# EAGLE design Adafruit Metro ESP32-S3 Rev B (EAGLE 9.6.2)
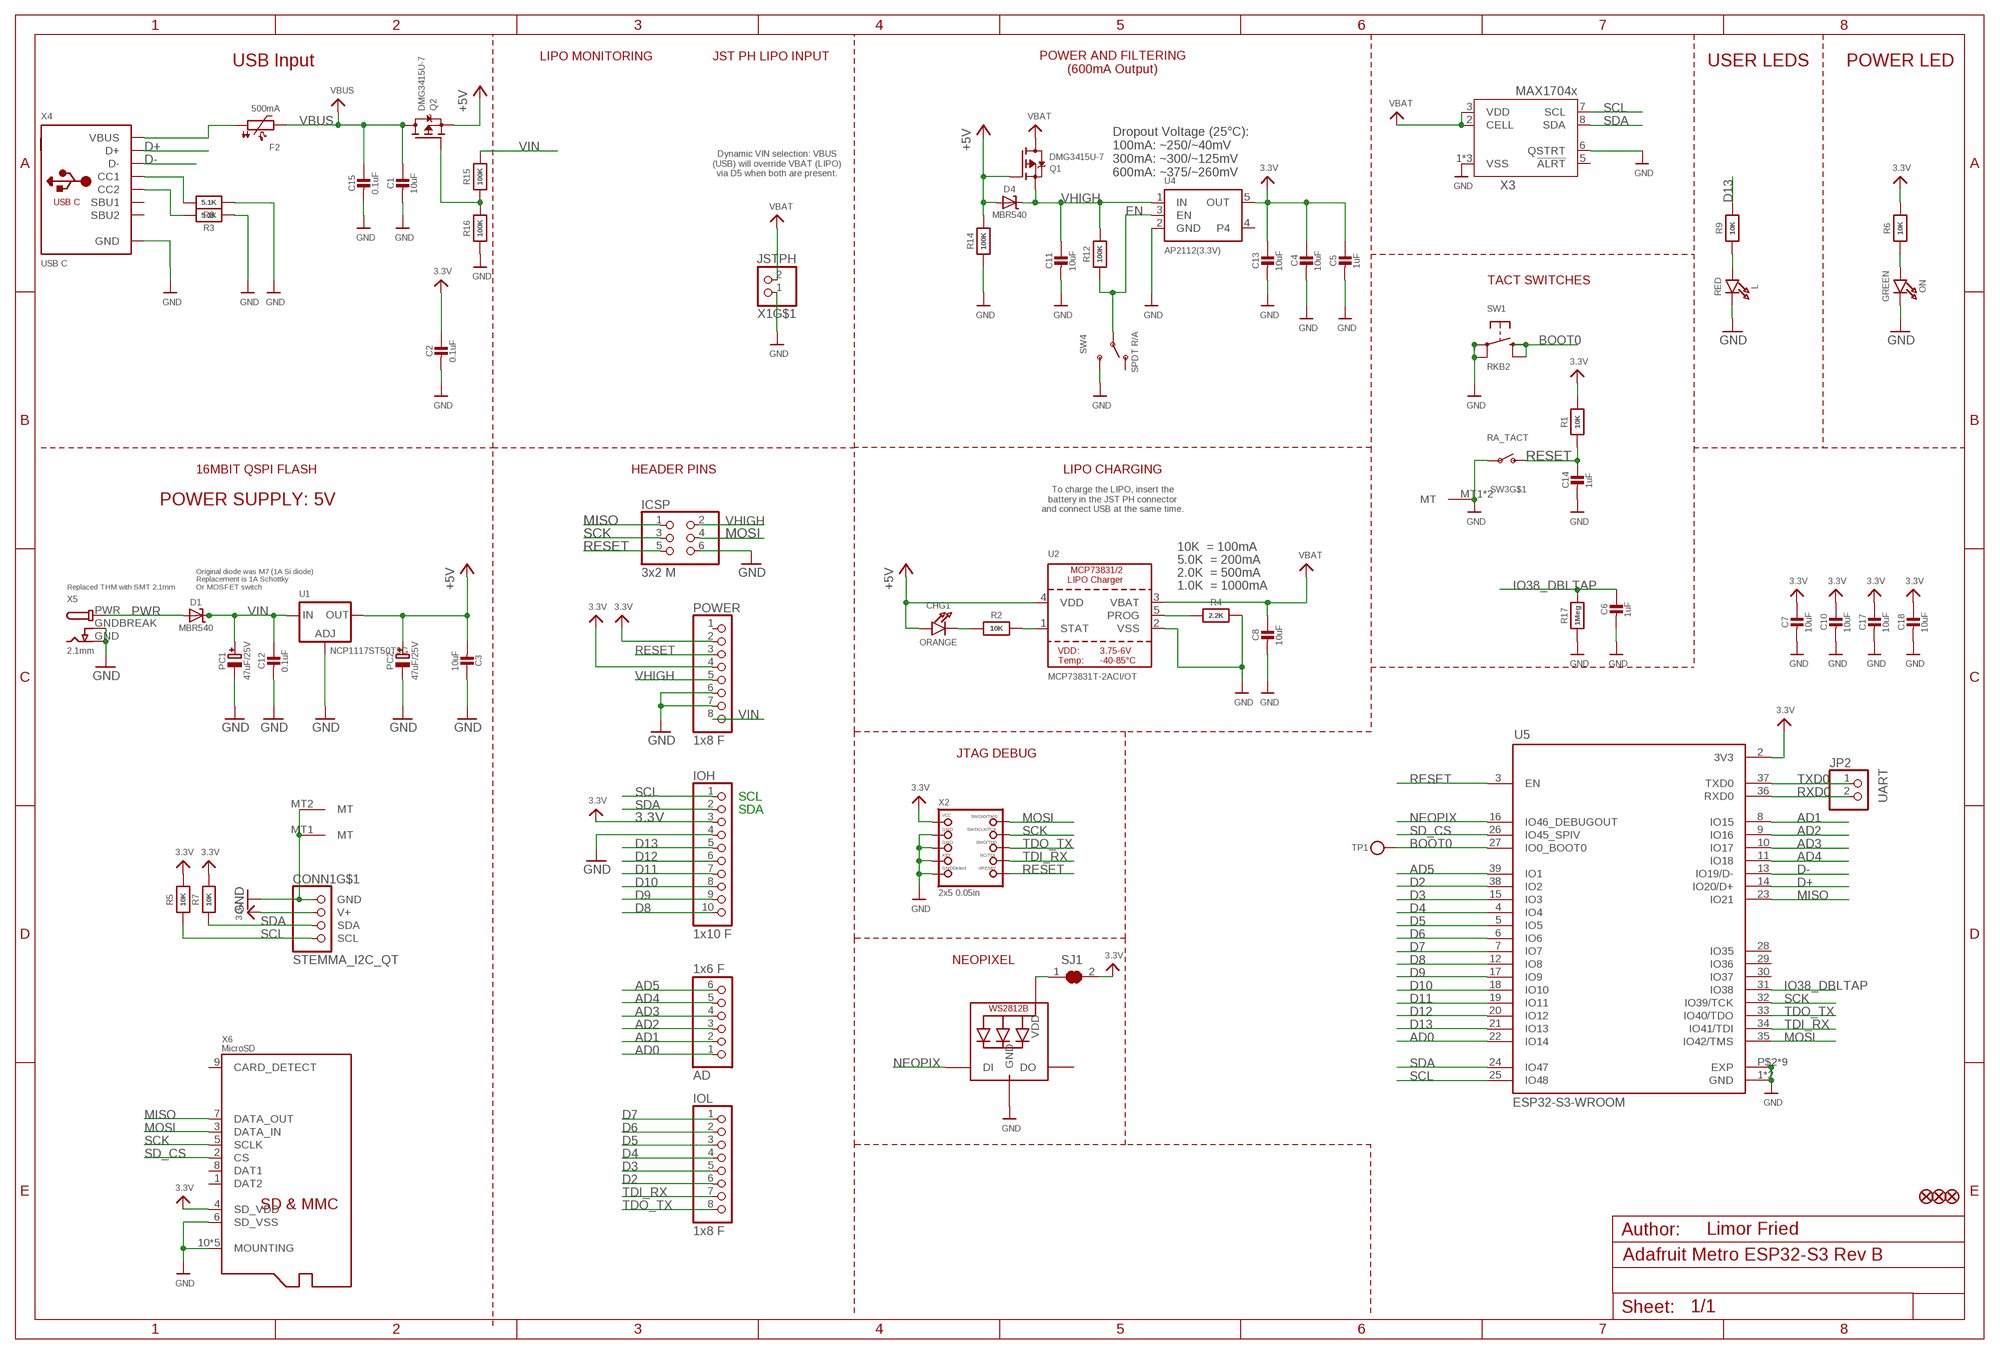
[diagram p0: schematic, sheet 1]

## Parts
AD  1x6 F  HEADER-1X6OVALWAVE  [1X06_OVALWAVE]
C1  10uF  CAP_CERAMIC0805-NOOUTLINE  [0805-NO]
C2  0.1uF  CAP_CERAMIC0603_NO  [0603-NO]
C3  10uF  CAP_CERAMIC0805-NOOUTLINE  [0805-NO]
C4  10uF  CAP_CERAMIC0805-NOOUTLINE  [0805-NO]
C5  1uF  CAP_CERAMIC0603_NO  [0603-NO]
C6  1uF  CAP_CERAMIC0603_NO  [0603-NO]
C7  10uF  CAP_CERAMIC0805-NOOUTLINE  [0805-NO]
C8  10uF  CAP_CERAMIC0805-NOOUTLINE  [0805-NO]
C10  10uF  CAP_CERAMIC0805-NOOUTLINE  [0805-NO]
C11  10uF  CAP_CERAMIC0805-NOOUTLINE  [0805-NO]
C12  0.1uF  CAP_CERAMIC0603_NO  [0603-NO]
C13  10uF  CAP_CERAMIC0805-NOOUTLINE  [0805-NO]
C14  1uF  CAP_CERAMIC0603_NO  [0603-NO]
C15  0.1uF  CAP_CERAMIC0603_NO  [0603-NO]
C17  10uF  CAP_CERAMIC0805-NOOUTLINE  [0805-NO]
C18  10uF  CAP_CERAMIC0805-NOOUTLINE  [0805-NO]
CHG1  ORANGE  LED0603_NOOUTLINE  [CHIPLED_0603_NOOUTLINE]
CONN1  STEMMA_I2C_QT  [JST_SH4]
D1  MBR540  DIODE-SCHOTTKYSOD-123  [SOD-123]
D4  MBR540  DIODE-SCHOTTKYSOD-123  [SOD-123]
F2  500mA  PTC_0805  [0805-NO]
FD1  FIDUCIAL_1MM  [FIDUCIAL_1MM]
FD2  FIDUCIAL_1MM  [FIDUCIAL_1MM]
FD3  FIDUCIAL_1MM  [FIDUCIAL_1MM]
ICSP  3x2 M  HEADER-2X3  [2X03_ROUND_70MIL]
IOH  1x10 F  HEADER-1X10OVALWAVE  [1X10_OVALWAVE]
IOL  1x8 F  HEADER-1X8OVALWAVE  [1X08_OVALWAVE]
JP2  UART  HEADER-1X2ROUND  [1X02_ROUND]
L  RED  LED0603_NOOUTLINE  [CHIPLED_0603_NOOUTLINE]
LED1  WS2812B_3535FULL  [LED3535_FULLPADS]
ON  GREEN  LED0603_NOOUTLINE  [CHIPLED_0603_NOOUTLINE]
PC1  47uF/25V  CAP_ELECTROLYTICPANASONIC_D  [PANASONIC_D]
PC2  47uF/25V  CAP_ELECTROLYTICPANASONIC_D  [PANASONIC_D]
POWER  1x8 F  HEADER-1X8OVALWAVE  [1X08_OVALWAVE]
Q1  DMG3415U-7  MOSFET-P  [SOT23-R]
Q2  DMG3415U-7  MOSFET-P  [SOT23-R]
R1  10K  RESISTOR_0603_NOOUT  [0603-NO]
R2  10K  RESISTOR_0603_NOOUT  [0603-NO]
R3  5.1K  RESISTOR_0603_NOOUT  [0603-NO]
R4  2.2K  RESISTOR_0603_NOOUT  [0603-NO]
R5  10K  RESISTOR_0603_NOOUT  [0603-NO]
R6  10K  RESISTOR_0603_NOOUT  [0603-NO]
R7  10K  RESISTOR_0603_NOOUT  [0603-NO]
R8  5.1K  RESISTOR_0603_NOOUT  [0603-NO]
R9  10K  RESISTOR_0603_NOOUT  [0603-NO]
R12  100K  RESISTOR_0603_NOOUT  [0603-NO]
R14  100K  RESISTOR_0603_NOOUT  [0603-NO]
R15  100K  RESISTOR_0603_NOOUT  [0603-NO]
R16  100K  RESISTOR_0603_NOOUT  [0603-NO]
R17  1Meg  RESISTOR_0603_NOOUT  [0603-NO]
SJ1  SOLDERJUMPER_CLOSED  [SOLDERJUMPER_CLOSEDWIRE]
SW1  RKB2  SWITCH_TACT_SMT_RKB2  [BTN_RKB2_4.6X2.8]
SW3  RA_TACT  SWITCH_SPST_MNT_TACT_RA  [SPST_TACTILE_RA]
SW4  SPDT R/A  SWITCH_SPDT  [SPDT_SMT_SSSS811101]
TP1  TESTPOINTROUND1.5MMNO  [TESTPOINT_ROUND_1.5MM_NO]
U1  NCP1117ST50T3G  LM1117SOT223-REFLOW  [SOT223-R]
U2  MCP73831T-2ACI/OT  MCP73831/2  [SOT23-5]
U4  AP2112(3.3V)  VREG_SOT23-5  [SOT23-5]
U5  ESP32-S3-WROOM  [S3-WROOM32]
X1  JSTPH  CON_JST_PH_2PIN_MT_BATT  [JSTPH2_BATT]
X2  2x5 0.05in  JTAG-CORTEXBOXPOSTS  [2X05_1.27MM_BOX_POSTS]
X3  MAX17048/T  [TDFN8_2X2MM]
X4  USB C  USB_C  [USB_C_CUSB31-CFM2AX-01-X]
X5  2.1mm  DCBARRELPTH  [DCJACK_2MM_PTH]
X6  MicroSD  MICROSD104031-0811  [MOLEX_104031-0811]

## Nets
3.3V [Power]: C2.1 C4.1 C5.1 C7.1 C10.1 C13.1 C17.1 C18.1 CONN1.2(V+) IOH.3 POWER.2 POWER.4 R1.2 R5.2 R6.2 R7.2 SJ1.2 U4.5(OUT) U5.2(3V3) X2.1(VCC) X6.4(SD_VDD)
+5V [Power]: C3.2 CHG1.A D4.A PC2.+ Q1.1(G) Q2.2(S) R14.2 U1.2(OUT) U1.4(OUT) U2.4(VDD)
AD0: AD.1 U5.22(IO14)
AD1: AD.2 U5.8(IO15)
AD2: AD.3 U5.9(IO16)
AD3: AD.4 U5.10(IO17)
AD4: AD.5 U5.11(IO18)
AD5: AD.6 U5.39(IO1)
BOOT0: SW1.B'(S1) SW1.B(S) TP1.P$1 U5.27(IO0_BOOT0)
D2: IOL.6 U5.38(IO2)
D3: IOL.5 U5.15(IO3)
D4: IOL.4 U5.4(IO4)
D5: IOL.3 U5.5(IO5)
D6: IOL.2 U5.6(IO6)
D7: IOL.1 U5.7(IO7)
D8: IOH.10 U5.12(IO8)
D9: IOH.9 U5.17(IO9)
D10: IOH.8 U5.18(IO10)
D11: IOH.7 U5.19(IO11)
D12: IOH.6 U5.20(IO12)
D13: IOH.5 R9.2 U5.21(IO13)
D+: U5.14(IO20/D+) X4.A6(D+) X4.B6(D+)
D-: U5.13(IO19/D-) X4.A7(D-) X4.B7(D-)
EN: R12.1 SW4.B(P) U4.3(EN)
GND [lowpower]: C1.2 C2.2 C3.1 C4.2 C5.2 C6.2 C7.2 C8.2 C10.2 C11.2 C12.2 C13.2 C14.2 C15.2 C17.2 C18.2 CONN1.1(GND) CONN1.MT1(MT) CONN1.MT2(MT) ICSP.6 IOH.4 L.C LED1.4(GND) ON.C PC1.- PC2.- POWER.6 POWER.7 R3.1 R4.2 R8.1 R14.1 R16.1 R17.1 SW1.A'(P1) SW1.A(P) SW3.1(P) SW3.MT1(MT) SW3.MT2(MT) SW4.C(S) U1.1(ADJ) U2.2(VSS) U4.2(GND) U5.1(GND) U5.40(GND) U5.P$2(EXP) U5.P$3(EXP) U5.P$4(EXP) U5.P$5(EXP) U5.P$6(EXP) U5.P$7(EXP) U5.P$8(EXP) U5.P$9(EXP) U5.P$10(EXP) X1.1 X2.3(GND) X2.5(GND) X2.7(KEY) X2.9(GNDDETECT) X3.1(VSS) X3.4(VSS) X3.6(QSTRT) X3.THERMAL(VSS) X4.A1B12(GND) X4.B1A12(GND) X5.GND X5.GNDBREAK X6.6(SD_VSS) X6.10(MOUNTING) X6.G1(MOUNTING) X6.G2(MOUNTING) X6.G3(MOUNTING) X6.G4(MOUNTING)
IO38_DBLTAP: C6.1 R17.2 U5.31(IO38)
MISO: ICSP.1 U5.23(IO21) X6.7(DATA_OUT)
MOSI: ICSP.4 U5.35(IO42/TMS) X2.2(SWDIO) X6.3(DATA_IN)
N$1: L.A R9.1
N$2: Q2.1(G) R15.1 R16.2
N$3: ON.A R6.1
N$4: CHG1.C R2.1
N$5 [Power]: LED1.2(VDD) SJ1.1
N$6: R2.2 U2.1(STAT)
N$7: R8.2 X4.A5(CC1)
N$8: R3.2 X4.B5(CC2)
N$9: R4.1 U2.5(PROG)
N$13: F2.1 X4.A4B9(VBUS) X4.B4A9(VBUS)
NEOPIX: LED1.1(DI) U5.16(IO46_DEBUGOUT)
PWR: D1.A X5.PWR
RESET: C14.1 ICSP.5 POWER.3 R1.1 SW3.2(S) U5.3(EN) X2.10(NRESET)
RXD0: JP2.2 U5.36(RXD0)
SCK: ICSP.3 U5.32(IO39/TCK) X2.4(SWDCLK) X6.5(SCLK)
SCL: CONN1.4(SCL) IOH.1 R5.1 U5.25(IO48) X3.7(SCL)
SD_CS: U5.26(IO45_SPIV) X6.2(CS)
SDA: CONN1.3(SDA) IOH.2 R7.1 U5.24(IO47) X3.8(SDA)
TDI_RX: IOL.7 U5.34(IO41/TDI) X2.8(TDI)
TDO_TX: IOL.8 U5.33(IO40/TDO) X2.6(SWO)
TXD0: JP2.1 U5.37(TXD0)
VBAT [Power]: C8.1 Q1.3(D) U2.3(VBAT) X1.2 X3.2(CELL) X3.3(VDD)
VBUS: C1.1 C15.1 F2.2 Q2.3(D)
VHIGH [Power]: C11.1 D4.C ICSP.2 POWER.5 Q1.2(S) R12.2 U4.1(IN)
VIN [USB]: C12.1 D1.C PC1.+ POWER.8 R15.2 U1.3(IN)
Unconnected: LED1.3(DO) POWER.1 SW4.A(O) U4.4 U5.28(IO35) U5.29(IO36) U5.30(IO37) X1.NC1 X1.NC2 X3.5(!ALRT) X4.A8(SBU1) X4.B8(SBU2) X6.1(DAT2) X6.8(DAT1) X6.9(CARD_DETECT)

## Notes on the sheet
- USB Input | LIPO MONITORING | JST PH LIPO INPUT | USER LEDS | POWER LED
- POWER AND FILTERING
  (600mA Output)
- Dynamic VIN selection: VBUS
  (USB) will override VBAT (LIPO)
  via D5 when both are present.
- Dropout Voltage (25°C):
  100mA: ~250/~40mV
  300mA: ~300/~125mV
  600mA: ~375/~260mV
- TACT SWITCHES
- 16MBIT QSPI FLASH | HEADER PINS | LIPO CHARGING
- POWER SUPPLY: 5V
- To charge the LIPO, insert the
  battery in the JST PH connector
  and connect USB at the same time.
- 10K  = 100mA
- 5.0K  = 200mA
- 2.0K  = 500mA
- Replaced THM with SMT 2.1mm
- Original diode was M7 (1A Si diode)
  Replacement is 1A Schottky
  Or MOSFET switch
- 1.0K  = 1000mA
- JTAG DEBUG
- SCL
- SDA
- NEOPIXEL
- Limor Fried

## Library data of the parts
AD = microbuilder:HEADER-1X6: PIN HEADER
C1-C8 C10-C15 C17 C18 = microbuilder:CAP_CERAMIC: Ceramic Capacitors For new designs, use the packages preceded by an '_' character since they are more reliable: The following footprints should be used on most boards: _0402 - Standard footprint for regular board layouts _0603 - Standard footprint for regular board layouts _0805 - Standard footprint for regular board layouts _1206 - Standard footprint for regular board layouts For extremely tight-pitch boards where space is at a premium, the following 'micro-pitch' footprints can be used (smaller pads, no silkscreen outline, etc.): _0402MP - Micro-pitch footprint for very dense/compact boards _0603MP - Micro-pitch footprint for very dense/compact boards _0805MP - Micro-pitch footprint for very dense/compact boards _1206MP - Micro-pitch footprint for very dense/compact boards
CHG1 L ON = microbuilder:LED: LED 0603 - 0603 Surface Mount Package 2mA: Green LED - Low Power (3.9mcd, 2ma, 1.7Vf) - Digikey: 475-2709-2-ND Orange LED - Low Power (9.8mcd, 2ma, 1.8Vf) - Digikey: 475-1194-2-ND Red LED - Low Power (5mcd, 2ma, 1.8Vf) - Digikey: 475-1195-2-ND Yellow LED - Low Power (7mcd, 2ma, 1.8Vf) - Digikey: 475-1196-2-ND 5mA: Blue LED - Low Power (17mcd, 5ma, 2.9Vf) - Digikey: LNJ937W8CRACT-ND 0805 - 0805 Surface Mount Package 2mA: Red LED (8.8mcd, 2mA, 1.8Vf, Clear) - Low Power [Digikey: 475-2510-1-ND] Green LED (5mcd, 2mA, 1.8Vf, Clear) - Low Power [Digikey: 475-2730-1-ND] Yellow LED (11.3mcd, 2mA, 1.8Vf, Clear) - Low Power [Digikey: 475-2555-1-ND] 20mA: Red LED (104mcd, 20mA, Diffused) - LS R976 [Digikey: 475-1278-6-ND] Red LED (12mcd, 20mA, 2.0Vf, Clear) - APT2012EC [Digikey: 754-1128-1-ND] Green LED (15mcd, 20mA, 2.2Vf, Clear) - APT2012GC [Digikey: 754-1131-1-ND] Orange LED (160mcd, 20mA, 2.1Vf, Clear) - APT2012SECK [Digikey: 754-1130-1-ND] 1206 - 1206 Surface Mount Package Green LED (26mcd, 20mA, Diffused) - LG N971 [Digikey: 475-1407-6-ND] Red LED (15mcd, 20mA, Diffused) - LH N974 [Digikey: 475-1416-6-ND] Cree - Cree High-Power Surface Mount LEDs XPEBWT-L1-0000-00D50 - White 111lm 350mA 2.9Vf 6200K 110° XTEAWT-00-0000-00000LEE3 - White 114lm 350mA 2.85Vf 5000K 115° Everlight - Everlight 45-21 Series Surface Mount LEDs 45-21/QK2C-B2832AC2CB2/2T - Warm White 2000mcd 20mA 3.25Vf 3050K 120° 45-21/LK2C-B38452C4CB2/2T - Nuetral White 2000mcd 20mA 3.25Vf 4150K 120° 45-21/LK2C-B50634C6CB2/2T - Cold White 2200mcd 20mA 3.25Vf 5650K 120° PLCC2 Reverse Mount LS T77K-J1L2-1-0-2-R18-Z - Red 11.25mcd 2mA 1.8Vf 630nm 120° LO T77K-L1M2-24-Z - Orange 19.6mcd 2mA 1.8Vf 606nm 120° LY T77K-K2M1-26-Z - Yellow 15.7mcd 2mA 1.8Vf 587nm 120°; ROT: 270
CONN1 = adafruit_electromech:STEMMA_I2C; LCSC: C2845363
D1 D4 = microbuilder:DIODE-SCHOTTKY
F2 = microbuilder:PTC: PTC (Resettable Fuse) 1206 Package 250mA PTC (16V Max, Time-to-Trip: 0.08s) - Digikey: F2110CT-ND 1210 Package 100mA PTC (30V Max, Time-to-Trip: 0.6s) - Digikey: MF-USMF010-2CT-ND 1812 Package 750mA PTC (24V Max, Time-to-Trip: 0.2s) - Digikey: MF-MSMF075/24-2CT-ND
FD1-FD3 = microbuilder:FIDUCIAL: Fiducial Alignment Points Various fiducial points for machine vision alignment.; BOM: EXCLUDE
ICSP = microbuilder:HEADER-2X3: PIN HEADER
IOH = microbuilder:HEADER-1X10: PIN HEADER
IOL POWER = microbuilder:HEADER-1X8: PIN HEADER
JP2 = microbuilder:HEADER-1X2: PIN HEADER
LED1 = microbuilder:WS2812B
PC1 PC2 = microbuilder:CAP_ELECTROLYTIC: Electrolytic Capacitors SMT PANASONIC_C - Size C Panasonic Electrolytic Aluminum Capacitor 47µF 16V 20% Electrolytic Capacitor [Digikey: PCE3890TR-ND] PANASONIC_D - Size D Panasonic Electrolytic Aluminum Capacitor 100µF 25V 20% Electrolytic Capacitor [Digikey: PCE3898TR-ND] PTH 3.5 mm grid, 8 mm diameter ... 3.5 mm grid, 10 mm diameter ...
Q1 Q2 = microbuilder:MOSFET-P: P-Channel Mosfet LEGEND VDS: Voltage Drain-Source ID: Drain Current RDS(ON): Drain-Source On-State Resistance VGS(TH): Gate-Source Threshold Voltage CISS: Drain-Source Input Capacitance SOT-23 Name VDS ID RDS(ON) VGS(TH) CISS Order Number IRLML5103 30V 760mA 600 mOhm -- 75pF @ 25V Digikey: IRLML5103PBFCT-ND IRLML6401 12V 4.3A 50 mOhm 950mV @ 250µA 830pF @ 10V Digikey: IRLML6401PBFTR-ND NTR0202PL 20V 400mA 800 mOhm 2.3V @ 250uA 70pF @ 5V Digikey: NTR0202PLT1GOSTR-ND NTR4101PT1G 20V 1.8A 85 mOhm 1.2V @ 250uA 675pF @ 10V Digikey: NTR4101PT1GOSCT-ND DMP2004K 20V 600mA 900 mOhm 1V @ 250uA 175pF @ 16V Digikey: DMP2004KDICT-ND PMV65XP 20V 3.9A 76 mOhm 950mV @ 1mA 725pF @ 20V Digikey: 568-2358-2-ND TO-252 Name VDS ID RDS(ON) VGS(TH) CISS Order Number AOD417 30V 25A 34 mOhm 3V @ 250µA 920pF @ 15V Digikey: 785-1106-2-ND PowerPak Name VDS ID RDS(ON) VGS(TH) CISS Order Number AON7401 30V 12A 14 mOhm 3V @ 250µA 2600pF @ 15V Digikey: 785-1302-1-ND
R1-R9 R12 R14-R17 = microbuilder:RESISTOR: Resistors For new designs, use the packages preceded by an '_' character since they are more reliable: The following footprints should be used on most boards: _0402 - Standard footprint for regular board layouts _0603 - Standard footprint for regular board layouts _0805 - Standard footprint for regular board layouts _1206 - Standard footprint for regular board layouts For extremely tight-pitch boards where space is at a premium, the following 'micro-pitch' footprints can be used (smaller pads, no silkscreen outline, etc.): _0402MP - Micro-pitch footprint for very dense/compact boards _0603MP - Micro-pitch footprint for very dense/compact boards _0805MP - Micro-pitch footprint for very dense/compact boards _1206MP - Micro-pitch footprint for very dense/compact boards
SJ1 = microbuilder:SOLDERJUMPER_CLOSED: Solder Jumper - Closed These solder jumpers are closed by default CLOSEDWIRE - 10 mil trace between pads that can be cut and resoldered later CLOSEDPERM - 63 mil trace between pads for a permanent connection (used to 'bridge' two signals, a shameless hack for Eagle). Can double as a test point as well (no cream layer)
SW1 = adafruit_electromech:SWITCH_TACT_SMT: SMT Tact Switches RKB2 https://www.digikey.com/short/m027prz5
SW3 = adafruit_electromech:SWITCH_SPST_MNT: Switch - SPST 4UCon 19192 (6.7x2.6mm SMT); LCSC: C778159
SW4 = adafruit_electromech:SWITCH_SPDT: Switch - SPDT SSSS811101 - Horizontal Two Position SMT, 0.3A 4V [Mouser: 688-SSSS811101]
TP1 = microbuilder:TESTPOINT: Test Point Various test points for characterisation and PCB testing TESTPOINT_SMT - Compact Surface Mount Test Point [Digikey: 5016KTR-ND]
U1 = microbuilder:LM1117: LM1117 Voltage Regulator LM1117 Adjustable Voltage regulator [Digikey: LM1117IMP-ADJDKR-ND] LM1117 3.3V Voltage regulator [AP1117E33GDIDKR-ND] LM1117 5.0V Voltage regulator [AP1117E50GDIDKR-ND] SOT223-REFLOW - SOT223 package for solder paste/reflow ovens SOT223-WAVE - SOT223 package for hand-soldering (larger pads) Note: For the fixed-voltage regulators, simply set the ADJ pin to GND.
U2 = microbuilder:MCP73831/2: MCP73831/2 LIPO Charger VDD: 3.75 - 6V Temp -40 - 85°C Programmable Charge Rate: 15-500mA NOTE: STAT is a tri-state logic output on the MCP73831 and an open-drain output on the MCP73832. SOT23-5 with 4.2V output and tri-state logic on STAT = MCP73831T-2ACI/OT; JLC_ROTATION: 0; LCSC: C424093
U4 = adafruit_power:VREG_SOT23-5: SOT23-5 Fixed Voltage Regulators Part Current Out V Out V In V Dropout θJA (°C/W) TJ (°C) Digikey Part No. ADP121 150mA 3.3V 3.4-5.5V 0.09V @ 150mA -- -- ADP121-AUJZ33R7CT-ND ADP121 150mA 3.0V 3.1-5.5V 0.09V @ 150mA -- -- ADP121-AUJZ30R7CT-ND ADP122 300mA 3.3V 3.4-5.5V 0.085V @ 300mA -- -- ADP122AUJZ-3.3-R7CT-ND ADP1712 300mA 3.3V 3.5-5.5V 0.17V @ 300mA -- -- ADP1712AUJZ-3.3-R7TR-ND AP7311 (Low Cost) 150mA 3.3V 3.5-6V 0.15V @ 150mA -- -- AP7311-33WG-7DICT-ND LD39015M18R 150mA 1.8V 1.9V-5.5V 0.08V @ 100mA -- -- 497-6977-1-ND LP2985A-33DBVR 150mA 3.3V 3.3-16V 0.28V @ 150mA 206 150 296-18479-1-ND MCP1824T-3302E/OT 300mA 3.3V 3.5V-6V 0.2V @ 300mA -- -- MCP1824T-3302E/OTCT-ND MIC5205-2.5YM5 TR 150mA 2.5V 2.7-16V 0.165V @ 150mA -- -- 576-1257-2-ND MIC5205-3.0YM5 TR 150mA 3.0V 3.2V-16V 0.165V @ 150mA -- -- 576-1258-2-ND MIC5205-3.3YM5 TR 150mA 3.3V 3.5V-16V 0.165V @ 150mA -- -- 576-1259-2-ND TPS780330220 150mA 3.3V+2.2V 3.6-5.5V 250mV Max -- -- 296-23332-1-ND TDA3663/N1,135 100mA 3.3V 3.5-45V 0.18V @ 50mA -- -- 568-5343-1-ND Max operating temp can be calculated using θJA, TJ (max junction temperature), and power in watts. Set the "Maximum Ambient Temperature" until it reaches TJ ("Max Junction Temperature"), which is the absolute limit for safe use of the regulator: Heat Sink Temperature Calculator <http://www.daycounter.com/Calculators/Heat-Sink-Temperature-Calculator.phtml> For example, With 12V source into a 3.3V LP2985 and a 30mA load, we are dissipating (12V-3.3V) * 0.03A = 0.261W. With a θJA of 206 °C/W, a TJ of 150°C, and 261mW we can safely use the chip without a heat sink up to 75°C (=147.1°C Junction Temperature).; JLC_ROTATION: 0
U5 = adafruit_wireless:ESP32-S3-WROOM: WiFi 802.11b/g/n Transceiver Module 2.4GHz Antenna Not Included Surface Mount Check prices <https://snapeda.com/parts/ESP32-S2-WROVER/Espressif%20Systems/view-part/?ref=eda>
X1 = adafruit_electromech:CON_JST_PH_2PIN_MT; LCSC: C47647
X2 = adafruit_electromech:JTAG-CORTEX: Serial Wire (SW-DP) Connector Standard 0.05" 10-pin connector is for use with the Cortex M and Cortex A SWD (serial wire debugger) interface (SW-DP) Connectors 2x05_1.27MM_SMT - Inexpensive surface-mount header with bare pins, compatible with standard 10-pin SWD cables (4UCON: 16846) 2x05_1.27MM_BOX_NOPOSTS - Polarised surface-mount box (4UCON with caps: 19735, without caps: 15117 2x05_1.27MM_BOX_POSTS - Polarised surface-mount box with mounting holes (4UCON: 20317) Pinout: http://infocenter.arm.com/help/topic/com.arm.doc.faqs/attached/13634/cortex_debug_connectors.pdf http://www.keil.com/peripherals/coresight/connectors.asp
X3 = adafruit_sensor:MAX17048; ROT: 270
X4 = adafruit_electromech:USB_C: USB Type-C USB 2.0 Connector; LCSC: C165948
X5 = adafruit_electromech:DCBARREL: DC Barrel Jack DCJACK_1.3MM_PTH - Through Hole 1.3mm Jack (4UConnector: 05536) DCJACK_2MM_PTH - Through Hole 2.0/2.1 Jack (4UConnector: 05537) DCJACK_2MM_SMT - SMT 2.0/2.1mm Jack(4UConnector: 03267)
X6 = adafruit_electromech:MICROSD: MicroSD/Transflash Card Holder with SPI pinout 3M: 2908-05WB-MG 4UConnector: 19656 Footprint courtesy: Adafruit Industries

## Net classes
2 lowpower: width 0.305 mm, drill 0.483 mm
3 Power: width 0.305 mm, drill 0.483 mm

## Board
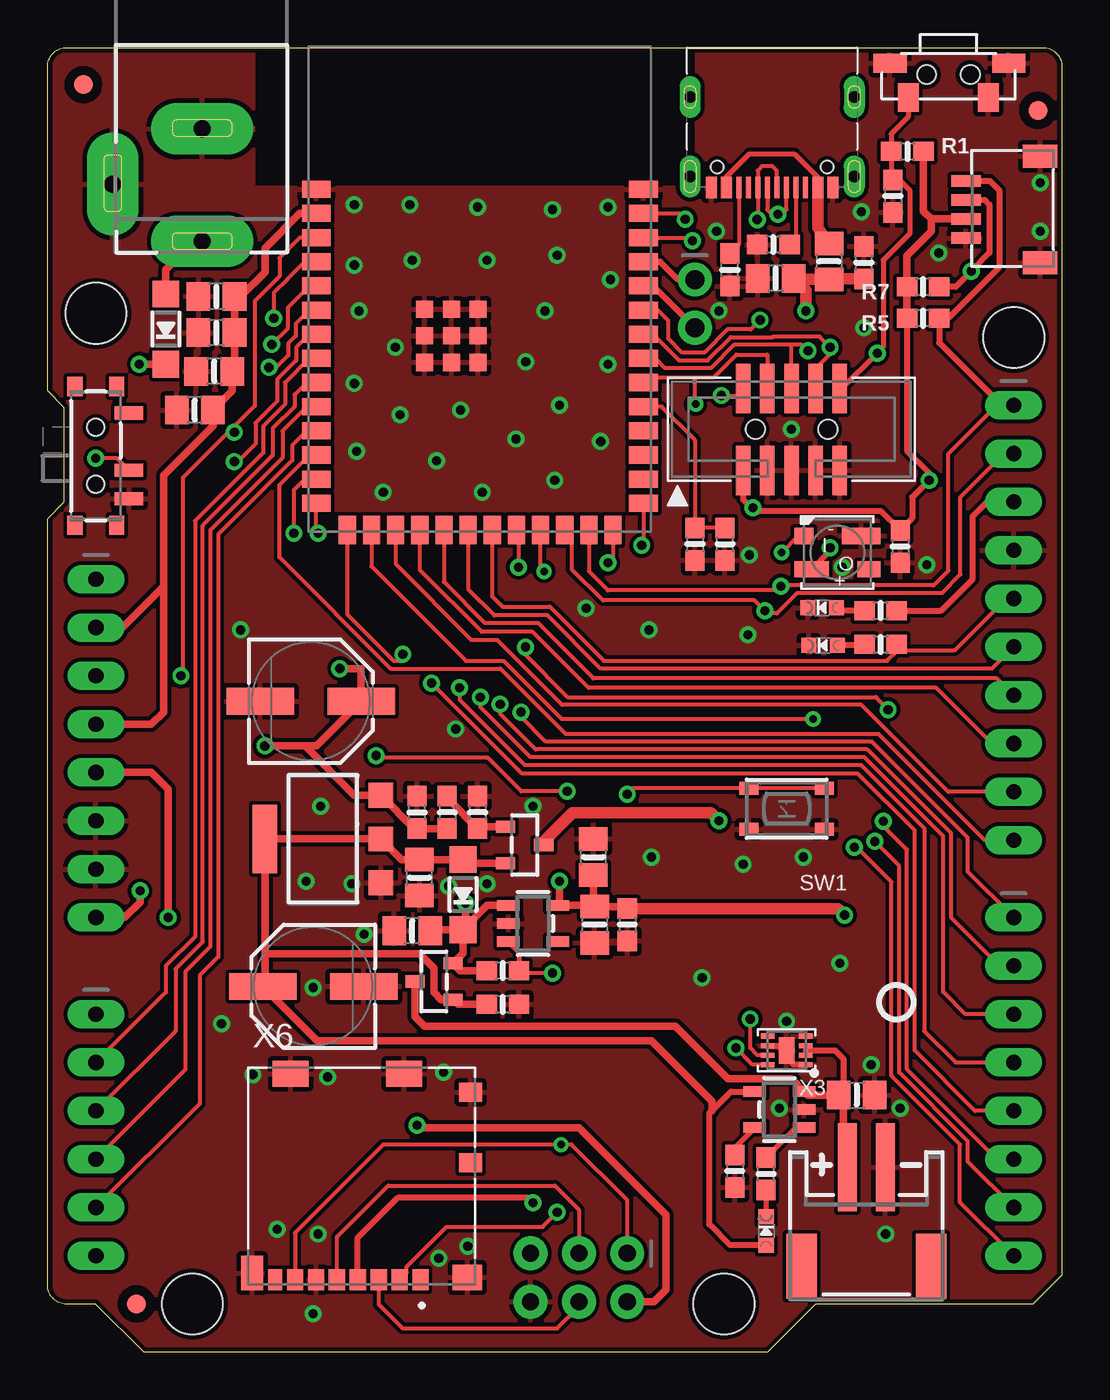
[diagram p1: board, top side]
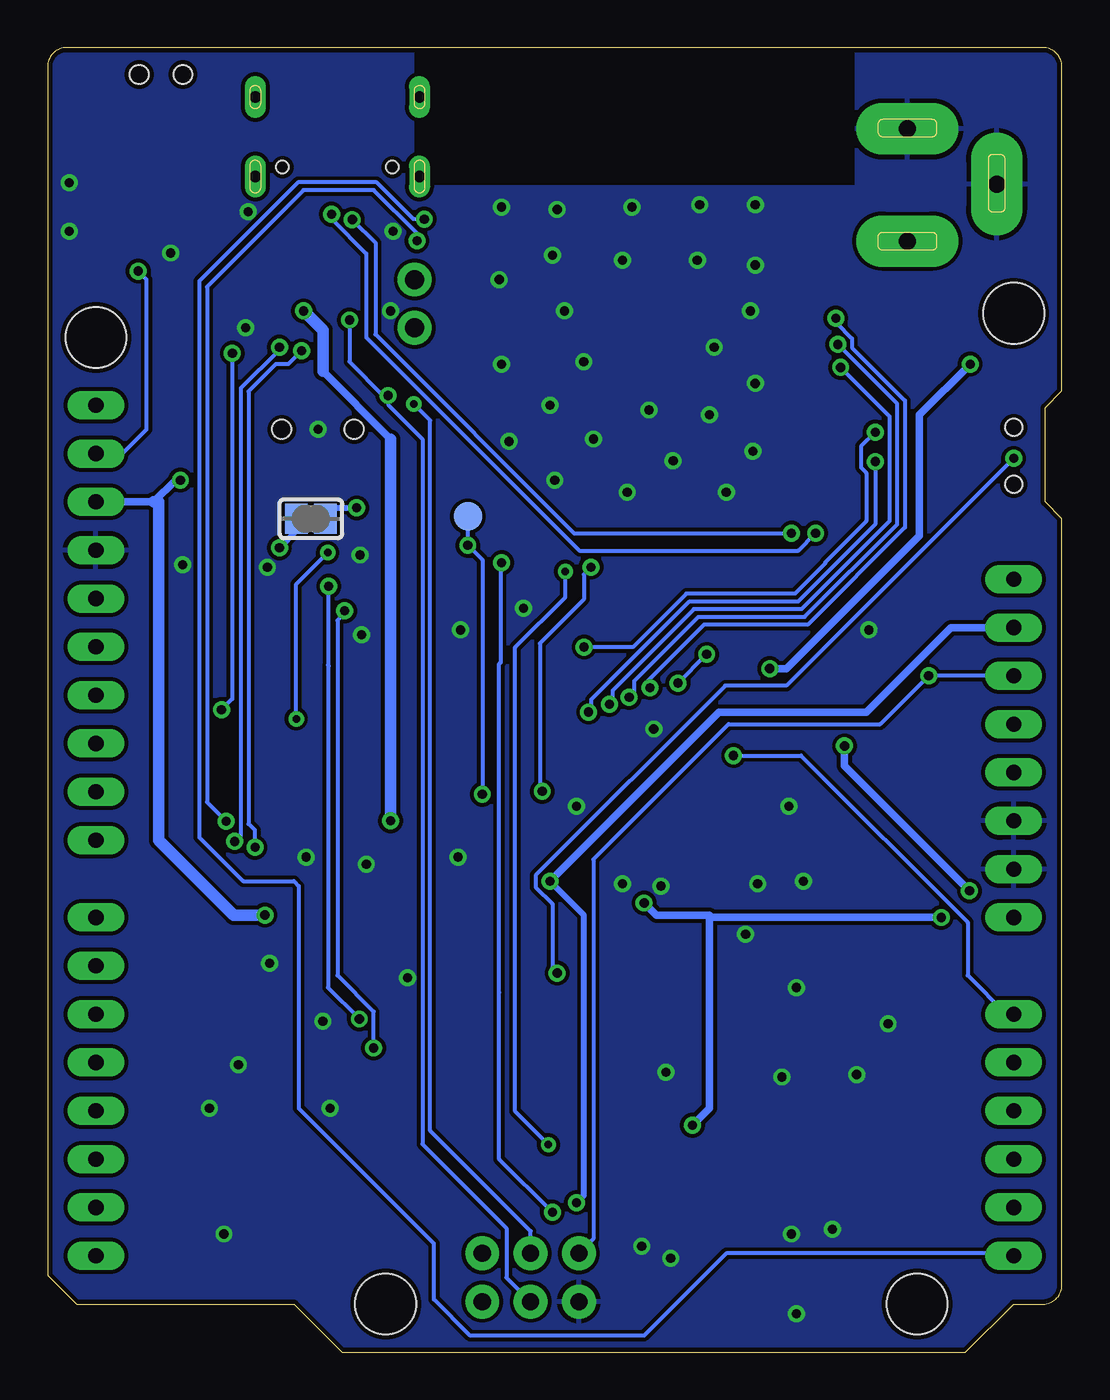
[diagram p2: board, bottom side, seen from below]

Size 53.34 x 68.58 mm. Coordinates in mm from the lower left corner, seen from the top.
Outline: 53.34,4.06 51.82,2.54 40.39,2.54 37.85,0 5.08,0 2.54,2.54 1,2.54 arc-90 0,3.54 0,43.81 0.89,44.7 0.89,49.66 0,50.55 0,67.58 arc-90 1,68.58 52.34,68.58 arc-90 53.34,67.58 53.34,4.06
Copper layers (1*16): Top 0.035mm / dielectric 1.5mm / Bottom 0.035mm
Design rules "adafruit *": minimum track width 8mil, minimum drill 15.5mil, track to track 8mil, track to pad 8mil, pad to pad 8mil, via to via 8mil, smd to smd 8mil, copper to edge 10mil, drill to drill 8mil, minimum pad ring 10mil, minimum via ring 8mil, stop-mask expansion 2mil, vias tented up to drill 20mil, thermal gap 10mil
Holes 3.2 mm at 35.56,2.54 7.62,2.54 50.8,53.34 2.54,54.61

### Footprints (pad centres in the part's own frame; a part is rotated, then mirrored left to right if it is on the bottom)
1X06_OVALWAVE = drill 0.8 pad 1.5 long: 1 -6.35,0; 2 -3.81,0; 3 -1.27,0; 4 1.27,0; 5 3.81,0; 6 6.35,0
0805-NO = smd 1.24 x 1.5: 1 -0.95,0; 2 0.95,0
0603-NO = smd 1.075 x 1: 1 -0.85,0; 2 0.85,0
CHIPLED_0603_NOOUTLINE = smd 0.8 x 0.8: A 0,-0.75; C 0,0.75
JST_SH4 = smd 0.6 x 1.55: 1 -1.5,2.006; 2 -0.5,2.006; 3 0.5,2.006; 4 1.5,2.006 | smd 1.2 x 1.8: MT1 -2.8,-1.894; MT2 2.8,-1.894
SOD-123 = smd 1.4 x 1.4: A 1.85,0; C -1.85,0
FIDUCIAL_1MM = smd 1 x 1: 1 0,0
2X03_ROUND_70MIL = drill 0.9 pad 1.778: 1 -2.54,-1.27; 2 -2.54,1.27; 3 0,-1.27; 4 0,1.27; 5 2.54,-1.27; 6 2.54,1.27
1X10_OVALWAVE = drill 0.8 pad 1.5 long: 1 -11.43,0; 2 -8.89,0; 3 -6.35,0; 4 -3.81,0; 5 -1.27,0; 6 1.27,0; 7 3.81,0; 8 6.35,0; 9 8.89,0; 10 11.43,0
1X08_OVALWAVE = drill 0.8 pad 1.5 long: 1 -8.89,0; 2 -6.35,0; 3 -3.81,0; 4 -1.27,0; 5 1.27,0; 6 3.81,0; 7 6.35,0; 8 8.89,0
1X02_ROUND = drill 1 pad 1.778: 1 -1.27,0; 2 1.27,0
LED3535_FULLPADS = smd 1 x 0.85: 1 -1.75,0.875 | smd 1.8 x 0.85: 2 -1.35,-0.875 | smd 1.2 x 0.85: 3 1.65,-0.875 | smd 2 x 0.85: 4 1.25,0.875
PANASONIC_D = smd 3.556 x 1.4: + 2.654,0; - -2.654,0
SOT23-R = smd 0.635 x 1.016: 1 -0.95,-1; 2 0.95,-1; 3 0,1
SOLDERJUMPER_CLOSEDWIRE = smd 1.168 x 1.6: 1 -0.762,0; 2 0.762,0 | smd 0.635 x 0.203: WIRE 0,0
BTN_RKB2_4.6X2.8 = smd 1 x 0.7: A 1.973,1.075; A' -1.973,1.075; B 1.973,-1.075; B' -1.973,-1.075
SPST_TACTILE_RA = smd 1.1 x 1.5: 1 2.1,-0.9; 2 -2.1,-0.9 | smd 1.75 x 1: MT1 3.175,0.9; MT2 -3.075,0.9 | hole 1: 1.15,0.3; -1.15,0.3
SPDT_SMT_SSSS811101 = smd 0.7 x 1.5: A -2.25,1.242; B 0.75,1.242; C 2.25,1.242 | smd 1 x 0.8: SUP1 -3.65,0.592; SUP2 -3.65,-1.608; SUP3 3.65,0.592; SUP4 3.65,-1.608 | hole 0.9: -1.5,-0.508; 1.5,-0.508
TESTPOINT_ROUND_1.5MM_NO = smd 1.5 x 1.5: P$1 0,0
SOT223-R = smd 1.3 x 1.3: 1 -2.3,-3.05; 2 0,-3.05; 3 2.3,-3.05 | smd 3.6 x 1.3: 4 0,3.05
SOT23-5 = smd 0.55 x 1.2: 1 -0.95,-1.3; 2 0,-1.3; 3 0.95,-1.3; 4 0.95,1.3; 5 -0.95,1.3
S3-WROOM32 = smd 1.5 x 0.9: 1 -8.6,9.064; 2 -8.6,7.794; 3 -8.6,6.524; 4 -8.6,5.254; 5 -8.6,3.984; 6 -8.6,2.714; 7 -8.6,1.444; 8 -8.6,0.174; 9 -8.6,-1.096; 10 -8.6,-2.366; 11 -8.6,-3.636; 12 -8.6,-4.906; 13 -8.6,-6.176; 14 -8.6,-7.446; 27 8.6,-7.446; 28 8.6,-6.176; 29 8.6,-4.906; 30 8.6,-3.636; 31 8.6,-2.366; 32 8.6,-1.096; 33 8.6,0.174; 34 8.6,1.444; 35 8.6,2.714; 36 8.6,3.984; 37 8.6,5.254; 38 8.6,6.524; 39 8.6,7.794; 40 8.6,9.064 | smd 0.9 x 1.5: 15 -6.97,-8.836; 16 -5.7,-8.836; 17 -4.43,-8.836; 18 -3.16,-8.836; 19 -1.89,-8.836; 20 -0.62,-8.836; 21 0.65,-8.836; 22 1.92,-8.836; 23 3.19,-8.836; 24 4.46,-8.836; 25 5.73,-8.836; 26 7,-8.836 | smd 0.9 x 0.9: P$2 -2.9,2.76; P$3 -2.9,1.36; P$4 -2.9,-0.04; P$5 -1.5,-0.04; P$6 -1.5,1.36; P$7 -1.5,2.76; P$8 -0.1,2.76; P$9 -0.1,1.36; P$10 -0.1,-0.04
JSTPH2_BATT = smd 1 x 4.6: 1 -1,-2.303; 2 1,-2.303 | smd 1.6 x 3.4: NC1 -3.4,2.897; NC2 3.4,2.897
2X05_1.27MM_BOX_POSTS = smd 0.76 x 2.6: 1 -2.54,-2.15; 2 -2.54,2.15; 3 -1.27,-2.15; 4 -1.27,2.15; 5 0,-2.15; 6 0,2.15; 7 1.27,-2.15; 8 1.27,2.15; 9 2.54,-2.15; 10 2.54,2.15 | hole 1: -1.905,0; 1.905,0
TDFN8_2X2MM = smd 0.7 x 0.275: 1 -1,0.75; 2 -1,0.25; 3 -1,-0.25; 4 -1,-0.75; 5 1,-0.75; 6 1,-0.25; 7 1,0.25; 8 1,0.75 | smd 0.8 x 1.38: THERMAL 0,0
USB_C_CUSB31-CFM2AX-01-X = smd 0.575 x 1.15: A1B12 -3.2,2.275; A4B9 -2.4,2.275; B1A12 3.2,2.275; B4A9 2.4,2.275 | smd 0.275 x 1.15: A5 -1.25,2.275; A6 -0.25,2.275; A7 0.25,2.275; A8 1.25,2.275; B5 1.75,2.275; B6 0.75,2.275; B7 -0.75,2.275; B8 -1.75,2.275 | drill 0.6 pad 1 long: M1 -4.32,1.7; M2 4.32,1.7; M3 -4.32,-2.48; M4 4.32,-2.48 | hole 0.65: 2.89,1.2; -2.89,1.2
DCJACK_2MM_PTH = drill 0.9 pad 2.7 long: GND -2.9,2.54; GNDBREAK 0,-2.16; PWR 3,2.54
MOLEX_104031-0811 = smd 0.85 x 1.1: 1 3.105,-5.45; 2 2.005,-5.45; 3 0.905,-5.45; 4 -0.195,-5.45; 5 -1.295,-5.45; 6 -2.395,-5.45; 7 -3.495,-5.45 | smd 0.75 x 1.1: 8 -4.545,-5.45 | smd 1.2 x 1: 9 5.74,0.7; 10 5.74,4.4 | smd 1.55 x 1.35: G1 5.565,-5.325 | smd 1.17 x 1.8: G2 -5.755,-5.1 | smd 1.9 x 1.35: G3 -3.73,5.375; G4 2.24,5.375

### Placement (x,y rotation side)
AD  2.54,11.43 270 top
C1  38.29,56.45 180 top
C2  44.83,42.35 270 top
C3  19.56,24.96 90 top
C4  28.7,26.04 90 top
C5  30.48,22.48 270 top
C6  34.04,42.48 270 top
C7  8.89,55.5 180 top
C8  42.55,13.53 0 top
C10  8.89,53.59 180 top
C11  19.18,22.16 180 top
C12  19.43,28.38 90 top
C13  28.77,22.48 270 top
C14  44.45,60.77 270 top
C15  42.93,57.28 90 top
C17  8.76,51.56 180 top
C18  7.75,49.53 180 top
CHG1  37.78,6.39 0 top
CONN1  50.29,60.07 90 top
D1  6.22,53.78 90 top
D4  21.84,24.07 90 top
F2  41.08,57.34 270 top
FD1  52.07,65.28 270 top
FD2  4.68,2.55 270 top
FD3  1.89,66.63 270 top
ICSP  27.94,3.94 180 top
IOH  50.8,38.35 270 top
IOL  50.8,13.97 270 top
JP2  34.04,55.12 270 top
L  40.78,37.16 90 top
LED1  41.53,42.04 0 top
ON  40.73,39.14 90 top
PC1  13.84,34.23 0 top
PC2  13.97,19.24 180 top
POWER  2.54,31.75 270 top
Q1  20.32,19.49 90 top
Q2  25.08,26.67 270 top
R1  45.21,63.12 0 top
R2  37.78,9.39 90 top
R3  35.88,56.9 90 top
R4  36.13,9.52 270 top
R5  46.04,54.36 180 top
R6  43.8,38.99 0 top
R7  46.04,56.01 180 top
R8  38.16,58.23 0 top
R9  43.8,37.21 0 top
R12  23.94,20.07 180 top
R14  23.94,18.29 180 top
R15  21.02,28.38 270 top
R16  22.61,28.38 270 top
R17  35.62,42.48 90 top
SJ1  39.5,43.81 0 bottom
SW1  38.86,28.58 180 top
SW3  47.37,66.87 0 top
SW4  3.05,47.12 270 top
TP1  31.24,43.94 0 bottom
U1  14.48,26.99 90 top
U2  38.48,12.76 90 top
U4  25.53,22.54 270 top
U5  22.73,52.07 0 top
U$15  [PCBFEAT-REV-040]  44.64,18.42 0 top
U$52  [METROS3_TOP]  0,-0.13 0 top
U$58  [METROS3_BOT]  53.34,-0.13 0 bottom
X1  43.05,7.43 180 top
X2  39.12,48.51 0 top
X3  38.86,15.87 180 top
X4  38.1,63.5 180 top
X5  5.59,61.4 270 top
X6  16.51,9.27 0 top

### Tracks (layer width: path | path; a pad name or v marks a point on that pad's centre or on a via)
3.3V  (via drill 0.48)
  Top 0.305: X6.4 16.32,6.03 18.41,8.13 25.27,8.13 v25.53,7.87 | X2.1 36.58,44.83 37.02,44.39 v37.08,44.39 37.14,44.39 37.31,44.22 43.81,44.22 C2.1 45.47,43.84 45.47,44.96 v46.35,45.85 46.35,46.23 45.19,47.4 R5.2 | R6.2 46.99,38.99 48.64,40.64 48.64,43.94 49.4,44.7 IOH.3
  Top 0.406: U5.2 13.26,59.86 11.43,58.04 11.43,56.77 10.16,55.5 C7.1 C10.1 9.84,51.69 C17.1 9.71,50.55 C18.1 8.7,48.7 6.1,46.1 6.1,40.26 | 28.7,23.49 U4.5 26.92,23.59 v26.92,24.77 | 28.7,23.49 C13.1 30.38,23.43 C5.1 | 28.7,23.49 C4.1 | POWER.2 3.94,38.1 6.1,40.26 | CONN1.2 46.47,59.57 | R1.2 46.06,59.98 46.47,59.57 | 46.47,59.57 46.47,58.92 45.19,57.63 R7.2 R5.2 | 6.1,40.26 6.1,33.65 5.46,33.02 POWER.4
  Top 0.61: v41.91,22.99 41.57,23.33 32.38,23.33 C5.1
  Bottom 0.305: v25.53,7.87 25.15,8.25 25.15,22.99 v26.92,24.77 | SJ1.2 38.16,44.39 v37.08,44.39
  Bottom 0.406: POWER.2 5.84,38.1 10.29,33.65 18.03,33.65 v26.92,24.77 | IOH.3 47.75,44.7 46.61,45.85 v46.35,45.85
  Bottom 0.61: v41.91,22.99 43.56,22.99 47.5,26.92 47.5,44.7 47.75,44.7
+5V
  Top 0.305: CHG1.A 35.89,5.64 34.8,6.73 34.8,12.57 34.92,12.7 35.94,13.71 U2.4
  Top 0.406: Q2.2 22.04,25.72 D4.A C3.2 18.61,25.91 U1.2 U1.4 11.43,20.96 | 11.43,20.96 11.43,19.35 PC2.+ 14.17,16.38 31.75,16.38 34.92,13.21 34.92,12.7 | R14.2 21.58,18.29 Q1.1 20.7,18.55 20.32,18.92 20.32,20.19 19.56,20.96 11.43,20.96
AD0  (via drill 0.48)
  Top 0.203: U5.22 24.77,43.12 v24.77,41.27 | v27.33,29.49 24.91,29.49 23.16,31.24 17.4,31.24 v17.27,31.37
  Bottom 0.203: v24.77,41.27 25.15,40.89 25.15,39.57 27.45,37.27 27.45,29.61 v27.33,29.49 | v17.27,31.37 13.72,31.37 4.95,22.61 4.95,19.81 2.92,17.78 AD.1
AD1
  Top 0.203: U5.8 13.75,52.24 12.48,50.97 12.48,49.83 11.34,48.69 11.34,47.28 7.76,43.7 7.76,21.86 6.22,20.32 6.22,18.92 AD.2
AD2
  Top 0.203: AD.3 6.73,16.89 6.73,20.16 8.17,21.59 8.17,43.47 11.85,47.15 11.85,48.56 12.99,49.7 12.99,50.34 13.62,50.97 U5.9
AD3
  Top 0.203: AD.4 7.24,14.86 7.24,20 8.57,21.34 8.57,43.23 12.36,47.02 12.36,48.43 13.62,49.7 U5.10
AD4
  Top 0.203: U5.11 13.62,48.43 12.86,47.67 12.86,46.89 8.98,43.01 8.98,20.79 8,19.81 8,13.08 AD.5
AD5  (via drill 0.48)
  Top 0.203: U5.39 33.23,59.86 v33.53,59.56
  Bottom 0.203: AD.6 2.67,5.21 17.65,5.21 21.97,0.89 31.11,0.89 33.02,2.79 33.02,5.71 40.13,12.83 40.13,24.51 40.39,24.77 43.05,24.77 45.36,27.08 45.36,56.3 40.17,61.49 36.03,61.49 34.1,59.56 v33.53,59.56
BOOT0  (via drill 0.48)
  Top 0.203: U5.27 31.33,42.51 v31.24,42.42 | SW1.B' SW1.B 30.79,29.65 v30.48,29.34
  Bottom 0.203: TP1.P$1 v31.24,42.42 30.48,41.66 v30.48,29.34
D2  (via drill 0.48)
  Top 0.203: IOL.6 49.91,10.16 45.19,14.88 45.19,26.43 43.95,27.66 v43.95,27.92 | v33.92,58.43 33.79,58.55 31.37,58.55 U5.38
  Bottom 0.203: v33.92,58.43 33.92,58.81 36.2,61.09 39.88,61.09 44.96,56.01 44.96,28.92 v43.95,27.92
D3  (via drill 0.48)
  Top 0.203: U5.15 15.76,38.79 18.2,36.35 18.68,36.35 v18.68,36.69 | IOL.5 48.77,12.7 45.59,15.87 45.59,27.43 42.6,30.42 24.95,30.42 v20.19,35.18
  Bottom 0.203: v20.19,35.18 v18.68,36.69 | v18.68,36.69
D4  (via drill 0.48)
  Top 0.203: U5.4 13.51,57.32 12.6,56.41 12.6,56.39 11.9,55.69 v11.9,54.36 | v21.67,34.94 21.67,34.3 25.09,30.88 42.77,30.88 46.1,27.55 46.1,16.89 47.75,15.24 IOL.4
  Bottom 0.203: v11.9,54.36 11.9,54.14 11.04,53.29 11.04,52.8 8.26,50.02 8.26,43.36 13.36,38.25 18.82,38.25 21.9,35.17 v21.67,34.94
D5  (via drill 0.48)
  Top 0.203: v11.79,52.98 12.65,53.83 12.65,54.93 13.77,56.05 U5.5 | IOL.3 48.26,17.78 47.09,18.95 47.09,27.14 42.94,31.29 25.39,31.29 22.76,33.92 v22.76,34.43
  Bottom 0.203: v11.79,52.98 8.66,49.85 8.66,43.53 13.53,38.66 19.13,38.66 22.5,35.28 22.5,34.68 v22.76,34.43
D6  (via drill 0.48)
  Top 0.203: v11.64,51.77 12.02,51.77 12.66,52.4 12.66,53.04 13.05,53.43 13.05,54.06 13.77,54.78 U5.6 | IOL.2 50.04,20.32 47.5,22.86 47.5,27.3 43.1,31.7 25.66,31.7 23.8,33.56 v23.8,34.07
  Bottom 0.203: v11.64,51.77 9.07,49.2 9.07,43.69 13.7,39.06 19.36,39.06 23.64,34.78 23.64,34.23 v23.8,34.07
D7  (via drill 0.48)
  Top 0.203: U5.7 13.77,53.51 13.08,52.82 13.08,52.14 12.08,51.14 12.08,50 10.93,48.86 10.93,47.75 10,46.82 v9.82,46.82 | IOL.1 48.39,25.27 48.39,27.05 43.33,32.11 26.19,32.11 24.89,33.4 v24.89,33.65
  Bottom 0.203: v9.82,46.82 9.82,43.52 13.87,39.47 19.58,39.47 24.77,34.29 24.77,33.78 v24.89,33.65
D8
  Top 0.203: U5.12 13.76,47.16 12.19,45.59 12.19,41.78 18.03,35.94 23.82,35.94 27.25,32.51 43.69,32.51 49.28,26.92 IOH.10
D9
  Top 0.203: U5.17 18.3,41.44 22.3,37.44 23.65,37.44 27.05,34.04 42.8,34.04 47.37,29.46 IOH.9
D10
  Top 0.203: U5.18 19.57,41.13 22.84,37.87 25.5,37.87 28.45,34.92 46.74,34.92 49.66,32 IOH.8
D11
  Top 0.203: U5.19 20.84,40.5 23.01,38.33 25.81,38.33 28.7,35.43 49.91,35.43 IOH.7
D12
  Top 0.203: U5.20 22.11,40.12 23.5,38.73 26.29,38.73 29.08,35.94 49.66,35.94 IOH.6
D13
  Top 0.203: U5.21 23.38,39.74 23.93,39.19 26.41,39.19 29.25,36.35 44.14,36.35 44.65,36.85 R9.2 44.78,37.08 44.78,36.91 47.7,36.91 50.42,39.62 IOH.5
D+  (via drill 0.48)
  Top 0.203: X4.A6 38.35,62.11 38.1,62.36 37.59,62.36 37.35,62.11 X4.B6 37.35,59.57 v37.32,59.54 | v14.22,43.05 14.13,43.14 U5.14
  Bottom 0.203: v37.32,59.54 36.1,58.33 36.1,53.5 25.65,43.05 v14.22,43.05
D-  (via drill 0.48)
  Top 0.203: X4.A7 37.85,60.07 38.1,59.82 v38.41,59.82 38.61,59.82 38.86,60.07 38.86,61.21 X4.B7 | v12.95,43.05 12.95,45.34 13.51,45.89 U5.13
  Bottom 0.203: v38.41,59.82 38.41,59.57 36.58,57.74 36.58,53.34 25.38,42.14 13.87,42.14 v12.95,43.05
EN  (via drill 0.48)
  Top 0.203: SW4.B 3.67,46.99 v2.54,46.99 | v26.54,19.94 24.92,19.94 R12.1
  Top 0.254: U4.3 24.79,21.03 R12.1
  Bottom 0.203: v2.54,46.99 14.49,35.04 17.71,35.04 27.67,25.08 27.67,24.46 26.8,23.58 26.8,20.19 v26.54,19.94
GND  (via drill 0.48)
  Top 0.305: X3.6 38.61,16.12 X3.THERMAL 38.86,15.49 39.23,15.12 X3.1
  other vias: 36.83,37.72 46.23,41.4 41.78,41.27 39.12,48.51 42.93,53.85 35.31,54.74 35.18,58.93 42.8,59.94 46.86,57.78 52.2,58.93 52.2,61.47 29.46,60.2 26.54,60.07 22.61,60.2 19.05,60.32 16.13,60.32 16.13,57.15 19.18,57.4 23.11,57.4 26.8,57.66 29.59,56.39 26.16,54.74 29.46,51.94 25.15,52.07 26.92,49.78 29.08,47.88 26.67,45.85 22.86,45.21 24.64,48.01 21.72,49.53 20.45,46.86 17.65,45.21 16.26,47.37 18.54,49.28 16.13,50.93 18.29,52.83 16.38,54.74 44.07,6.22 38.48,12.83 38.86,17.4 43.31,15.11 44.83,12.83 22.1,5.59 20.57,4.95 12.06,6.48 14.22,6.22 13.97,2.03 14.73,14.48 10.79,14.6 20.83,14.73 13.97,19.18 16.64,21.97 16,24.64 23.11,24.64 21.08,24.51 36.58,25.65 39.75,26.04 31.75,26.04 34.42,19.69 41.66,20.45 31.62,37.97 28.32,39.12 25.53,28.7 21.46,32.77 14.35,28.7 13.59,24.77 9.14,17.27 10.16,37.97 36.91,41.91
  pour Top (rank 3): 53.34,68.45 53.34,-0.13 0,-0.13 0,68.45 10.79,68.58 10.79,61.21 34.16,61.21 34.16,68.58
  pour Bottom (rank 3): 53.34,68.45 53.34,-0.13 0,-0.13 0,68.58 10.79,68.58 10.79,61.21 34.16,61.21 34.16,68.58
IO38_DBLTAP
  Top 0.203: R17.2 C6.1 34.04,47.95 32.29,49.7 U5.31
MISO  (via drill 0.39)
  Top 0.203: ICSP.1 30.48,8 27.56,10.92 v27,10.92 17.65,10.92 13.02,6.28 X6.7 | v26.11,41.05 25.92,41.23 U5.23
  Bottom 0.203: v27,10.92 28.75,12.67 28.75,37.06 26.11,39.7 v26.11,41.05
MOSI  (via drill 0.48)
  Top 0.203: X6.3 17.41,2.52 18.67,1.27 26.8,1.27 27.94,2.41 ICSP.4 | v35.43,50.29 36.58,50.29 X2.2 | v37.47,54.26 36.97,53.77 35.76,53.77 34.54,52.55 33.37,52.55 32.64,53.28 32.64,54.23 32.08,54.78 U5.35
  Bottom 0.203: v37.47,54.26 37.47,52.07 35.69,50.29 v35.43,50.29 35.43,49.81 33.63,48.01 33.63,10.95 29.21,6.53 29.21,3.94 ICSP.4
N$1
  Top 0.305: R9.1 42.9,37.16 L.A
N$2
  Top 0.406: Q2.1 22.69,27.62 R16.2 21.93,28.22 21.93,28.24 21.02,29.15 R15.1
N$3
  Top 0.305: R6.1 41.63,38.99 ON.A
N$4
  Top 0.254: R2.1 CHG1.C
N$5  (via drill 0.48)
  Top 0.305: LED1.2 41.15,42.13 v41.15,42.29
  Bottom 0.305: v41.15,42.29 40.26,43.18 SJ1.1
N$6
  Top 0.254: R2.2 39.36,11.81 U2.1
N$7
  Top 0.203: X4.A5 39.35,58.57 R8.2
N$8
  Top 0.203: X4.B5 36.35,58.22 R3.2
N$9
  Top 0.254: R4.1 36.13,10.76 U2.5
N$13
  Top 0.254: X4.B4A9 35.7,61.79 36.9,62.99 39.26,62.99 40.5,61.75 X4.A4B9
  Top 0.61: X4.A4B9 40.5,59.12 F2.1
NEOPIX  (via drill 0.4)
  Top 0.203: U5.16 17.03,41.31 22,36.35 23.98,36.35 27.03,33.3 v40.26,33.3 | v38.61,42.04 39.48,42.91 LED1.1
  Bottom 0.203: v40.26,33.3 40.26,40.39 v38.61,42.04
PWR
  Top 0.406: D1.A 6.22,56.9 7.72,58.4 X5.PWR
RESET  (via drill 0.48)
  Top 0.203: U5.3 13.26,58.59 12.19,57.53 12.19,56.56 10.89,55.26 10.89,49.75 9.72,48.58 | v7.01,35.56 7.11,35.66 7.11,45.97 9.72,48.58 | 9.72,48.58 9.82,48.47 v9.82,48.37 | 43.94,52.83 v43.62,52.52 | v25.13,37.07 25.13,36.66 27.35,34.44 43.56,34.44 44.2,33.81 v44.2,33.78
  Top 0.254: SW3.2 45.27,64.96 44.36,64.05 R1.1 44.36,61.71 C14.1 44.81,61.62 45.34,61.09 45.34,58.8 43.94,57.4 43.94,52.83 | X2.10 41.77,50.66 v43.62,52.52
  Bottom 0.203: POWER.3 v7.01,35.56 9.55,33.02 17.53,33.02 24.64,25.91 24.64,5.97 ICSP.5 | v9.82,48.37 10.57,47.62 10.57,46.51 10.29,46.23 10.29,43.69 12.45,41.53 12.45,41.47 14.04,39.88 19.75,39.88 22.56,37.07 v25.13,37.07 | v43.62,52.52 43.62,34.35 v44.2,33.78
RXD0
  Top 0.305: U5.36 31.83,56.05 JP2.2
SCK  (via drill 0.39)
  Top 0.203: X6.5 15.21,6.07 17.91,8.76 26.67,8.76 27.94,7.49 ICSP.3 | 34.04,51.23 35,51.23 36.22,52.45 37.85,52.45 X2.4 | 34.04,51.23 32.05,51.23 31.59,51.23 U5.32 | v34.08,49.84 34.04,49.89 34.04,51.23
  Bottom 0.203: ICSP.3 27.94,6.38 33.22,11.66 33.22,48.99 v34.08,49.84
SCL  (via drill 0.48)
  Top 0.203: U5.25 28.46,41.06 29.46,40.06 38.34,40.06 v38.56,40.27 38.59,40.31 46.59,40.31 47.37,41.09 47.37,47.24 49.91,49.78 IOH.1 | X3.7 37.32,15.62 36.94,16 v36.94,17.53
  Top 0.305: CONN1.4 49.55,61.57 50.04,61.09 50.04,57.02 47.37,54.36 R5.1 46.89,53.06 50.16,49.78 IOH.1
  Bottom 0.203: v36.94,17.53 38.59,19.18 38.59,36.12 38.56,36.08 v38.56,40.27
SD_CS  (via drill 0.48)
  Top 0.203: X6.2 18.89,4.19 18.89,4.5 20.99,6.6 26.04,6.6 v26.8,7.37 | U5.26 29.73,41.77 v29.46,41.5
  Bottom 0.203: v29.46,41.5 29.52,41.45 29.52,36.27 29.59,36.2 29.59,18.92 29.59,10.16 v26.8,7.37
SDA  (via drill 0.48)
  Top 0.203: IOH.2 50.29,47.24 48.01,44.96 48.01,40.89 47.02,39.9 39.41,39.9 38.35,38.85 37.85,38.85 v37.72,38.98 37.17,39.52 29.21,39.52 27.56,41.17 27.56,42.87 U5.24 | X3.8 37.07,15.12 v36.2,16
  Top 0.305: CONN1.3 49.28,60.57 49.53,60.32 49.53,57.78 v48.58,56.83 47.75,56.01 R7.1
  Bottom 0.203: IOH.2 49.4,47.24 48.13,48.51 48.13,56.39 v48.58,56.83 | v37.72,38.98 37.72,38.85 38.1,38.47 38.1,19.81 36.2,17.91 v36.2,16
TDI_RX  (via drill 0.48)
  Top 0.203: IOL.7 48.39,10.03 48.39,11.11 44.78,14.72 44.78,25.57 v43.49,26.86 | U5.34 31.83,53.51 33.2,52.14 34.7,52.14 35.93,53.36 38.13,53.36 38.16,53.39 40.59,53.39 v41.15,52.83 41.15,52.45 40.39,51.69 X2.8
  Bottom 0.203: v41.15,52.83 41.15,52.7 43.18,50.67 43.18,27.17 v43.49,26.86
TDO_TX  (via drill 0.48)
  Top 0.203: U5.33 31.97,52.24 32.48,51.74 34.87,51.74 36.1,52.96 39.12,52.96 | IOL.8 47.98,7.9 47.98,10.94 44.37,14.55 44.37,24.73 42.56,26.54 v42.43,26.54 | v39.99,52.64 39.67,52.96 39.12,52.96 | X2.6 39.12,52.96
  Bottom 0.203: v42.43,26.54 42.43,27.43 42.77,27.78 42.77,50.5 41.32,51.96 40.67,51.96 v39.99,52.64
TXD0
  Top 0.305: U5.37 32.21,57.32 33.15,56.39 JP2.1
VBAT
  Top 0.254: X3.3 39.86,15.87 X3.2
  Top 0.305: 39.86,15.87 41.4,15.87 41.85,15.43 41.85,13.33
  Top 0.406: X1.2 41.85,9.94 41.85,13.33 41.66,13.52 C8.1 39.97,13.52 U2.3 39.1,14.39 35.77,14.39 33.02,17.14 19.81,17.14 19.32,17.64 Q1.3
VBUS  (via drill 0.48)
  Top 0.406: F2.2 41.12,56.43 | 39.3,56.39 C1.1
  Top 0.61: C15.1 41.12,56.43 | F2.2 39.3,56.39 | C1.1 39.88,55.81 v39.88,54.74 | Q2.3 26.08,26.84 27.6,28.36 34.89,28.36 v35.31,27.94
  Bottom 0.406: 38.86,51.56 35.31,48.01
  Bottom 0.61: v39.88,54.74 38.86,53.72 38.86,51.56 | 35.31,48.01 v35.31,27.94
VHIGH  (via drill 0.48)
  Top 0.406: C11.1 20.18,22.22 21.59,22.22 | 21.59,22.22 D4.C | U4.1 23.12,23.49 D4.C | D4.C 21.84,20.97 Q1.2 21.7,20.07 R12.2 | POWER.5 5.46,30.48 6.35,29.59 v6.35,22.86 | v21.97,23.62 21.97,22.6 21.59,22.22 | ICSP.2 31.88,2.67 32.51,3.3 32.51,7.24 27.94,11.81 19.43,11.81 v19.43,11.94
  Bottom 0.406: v6.35,22.86 18.54,22.86 | v21.97,23.62 21.34,22.99 18.54,22.99 18.54,22.86 | v19.43,11.94 18.54,12.83 18.54,22.86
VIN  (via drill 0.48)
  Top 0.406: R15.2 C12.1 19.28,27.54 U1.3 16.13,29.29 13.54,31.88 v11.43,31.88 14.15,31.88 PC1.+ 16.5,35.94 v15.37,35.94 | POWER.8 4.06,22.86 4.86,23.66 v4.86,24.26 | D1.C v4.83,51.93 v4.83,51.94
  Bottom 0.406: v11.43,31.88 11.43,30.83 v4.86,24.26 | v4.83,51.94 7.49,49.28 7.49,42.93 14.48,35.94 v15.37,35.94

### Text on the board
214bmp: D:/SmartProjects/Snc/a4_bn_logo2.bmp